# EAGLE schematic mippe_mobo (EAGLE 9.5.2)

## Sheet 1 of 4
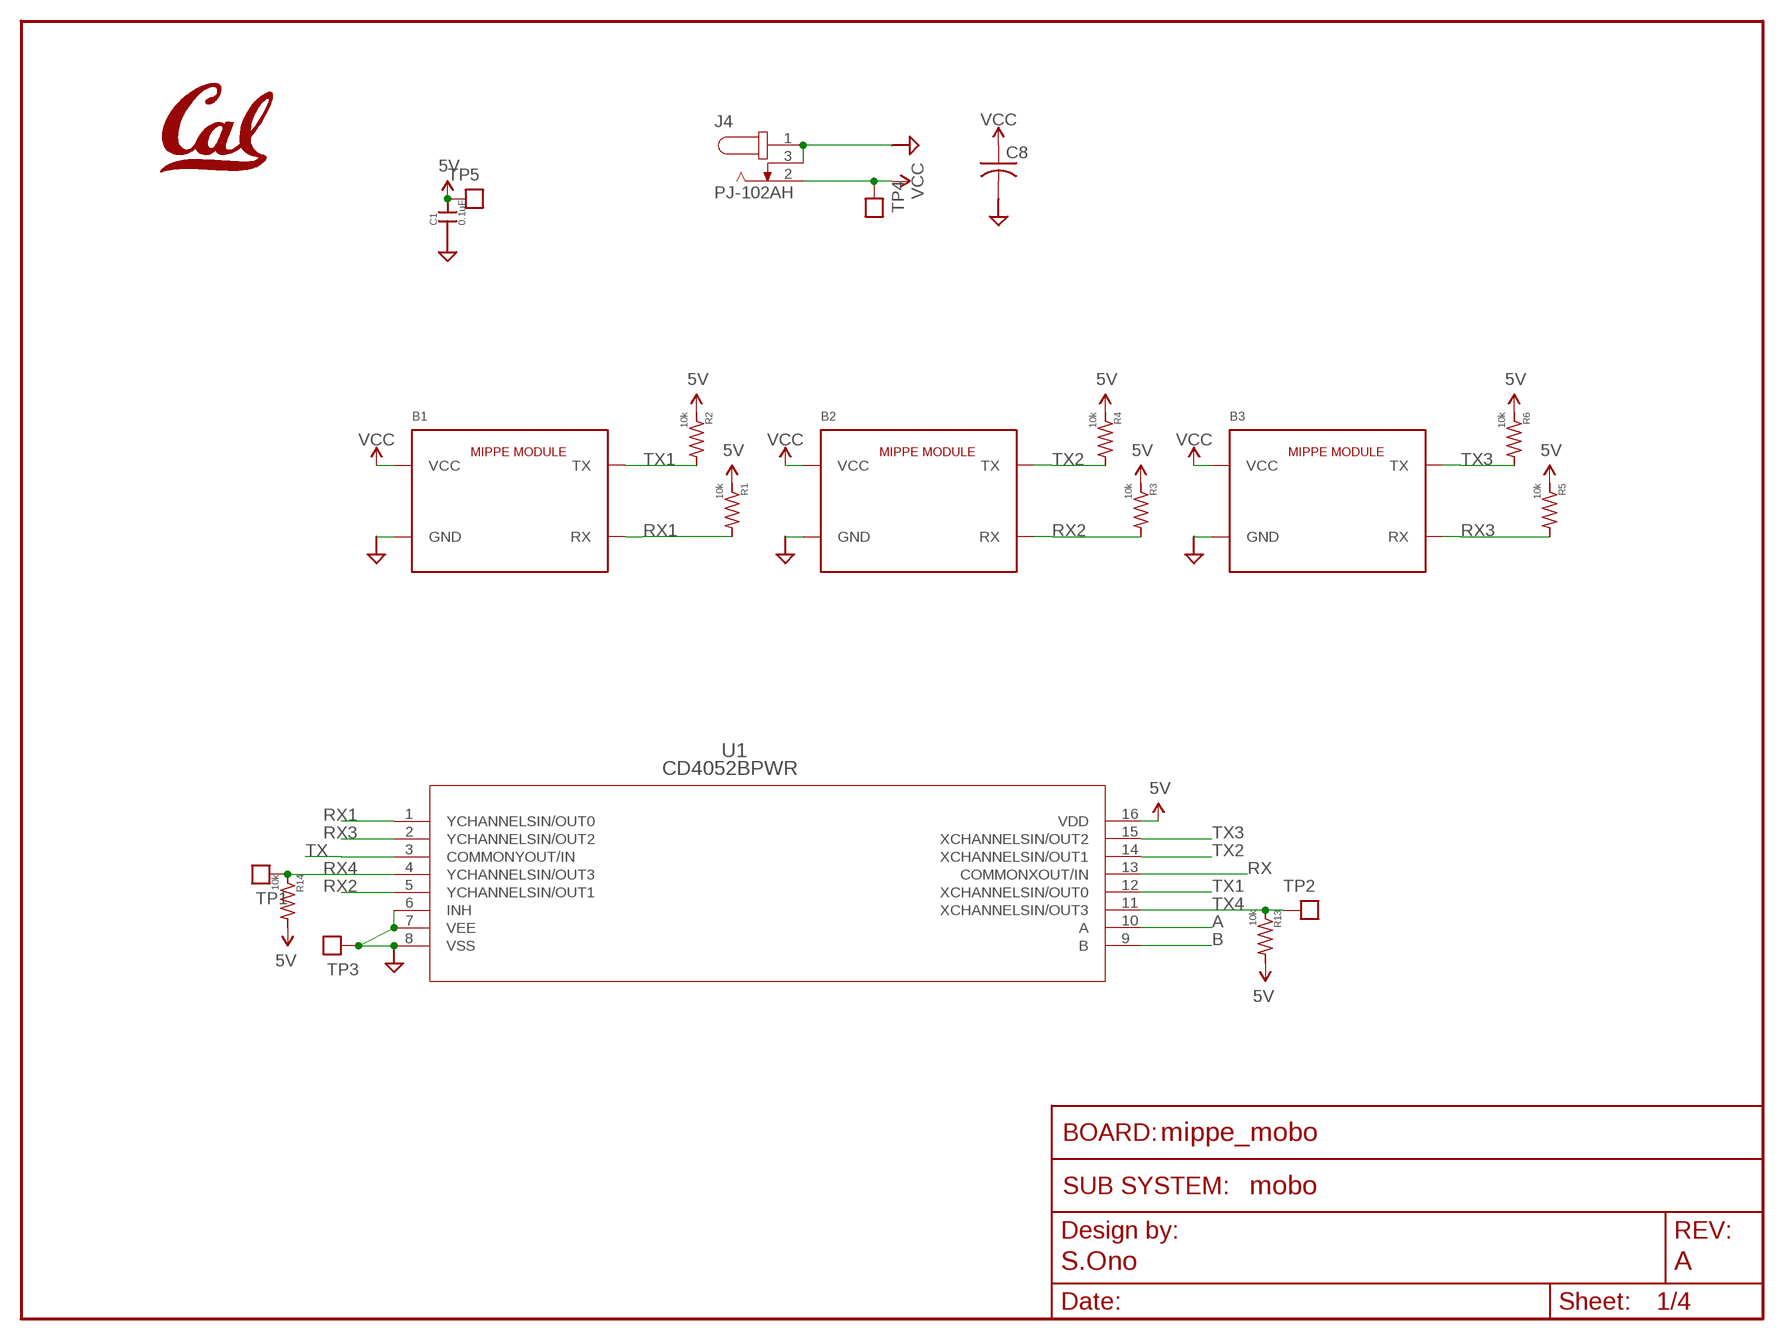
[diagram p0: schematic, sheet 1]
FRAME1 (FRAME_SCHEMATIC): AUTHOR: S.Ono; REV: A; SUBSYSTEM_NAME: mobo

### Parts
B1  MIPPE_MOD  [MIPPE_MOD]
B2  MIPPE_MOD  [MIPPE_MOD]
B3  MIPPE_MOD  [MIPPE_MOD]
C1  0.1uF  CAP0402-CAP  [0402-CAP]
C8  CAP_ELEC_3MM_SMD  [CAP_3MM]
J4  PJ-102AH  [CUI_PJ-102AH]
L1  UCB_CAL500MIL  [UCB_CAL_500MIL]
R1  10k  R-US_R0402  [R0402]
R2  10k  R-US_R0402  [R0402]
R3  10k  R-US_R0402  [R0402]
R4  10k  R-US_R0402  [R0402]
R5  10k  R-US_R0402  [R0402]
R6  10k  R-US_R0402  [R0402]
R13  10k  R-US_R0402  [R0402]
R14  10k  R-US_R0402  [R0402]
TP1  TEST_POINTTHRU  [TEST_POINT]
TP2  TEST_POINTTHRU  [TEST_POINT]
TP3  TEST_POINTTHRU  [TEST_POINT]
TP4  TEST_POINTTHRU  [TEST_POINT]
TP5  TEST_POINTTHRU  [TEST_POINT]
U1  CD4052BPWR  [PW16]

### Nets
5V: C1.2 R1.1 R2.1 R3.1 R4.1 R5.1 R6.1 R13.2 R14.2 TP5.1 U1.16(VDD) ; also sheet 3,4
A: U1.10(A) ; also sheet 4
B: U1.9(B) ; also sheet 4
GND: B1.GND@0(GND) B1.GND@1(GND) B1.GND@2(GND) B1.GND@3(GND) B2.GND@0(GND) B2.GND@1(GND) B2.GND@2(GND) B2.GND@3(GND) B3.GND@0(GND) B3.GND@1(GND) B3.GND@2(GND) B3.GND@3(GND) C1.1 C8.NEG J4.1 J4.3 TP3.1 U1.6(INH) U1.7(VEE) U1.8(VSS) ; also sheet 2,3,4
RX: U1.13(COMMONXOUT/IN) ; also sheet 4
RX1: B1.RX R1.2 U1.1(YCHANNELSIN/OUT0)
RX2: B2.RX R3.2 U1.5(YCHANNELSIN/OUT1)
RX3: B3.RX R5.2 U1.2(YCHANNELSIN/OUT2)
RX4: R14.1 TP1.1 U1.4(YCHANNELSIN/OUT3)
TX: U1.3(COMMONYOUT/IN) ; also sheet 4
TX1: B1.TX R2.2 U1.12(XCHANNELSIN/OUT0)
TX2: B2.TX R4.2 U1.14(XCHANNELSIN/OUT1)
TX3: B3.TX R6.2 U1.15(XCHANNELSIN/OUT2)
TX4: R13.1 TP2.1 U1.11(XCHANNELSIN/OUT3)
VCC: B1.VCC@0(VCC) B1.VCC@1(VCC) B1.VCC@2(VCC) B1.VCC@3(VCC) B2.VCC@0(VCC) B2.VCC@1(VCC) B2.VCC@2(VCC) B2.VCC@3(VCC) B3.VCC@0(VCC) B3.VCC@1(VCC) B3.VCC@2(VCC) B3.VCC@3(VCC) C8.POS J4.2 TP4.1

## Sheet 2 of 4
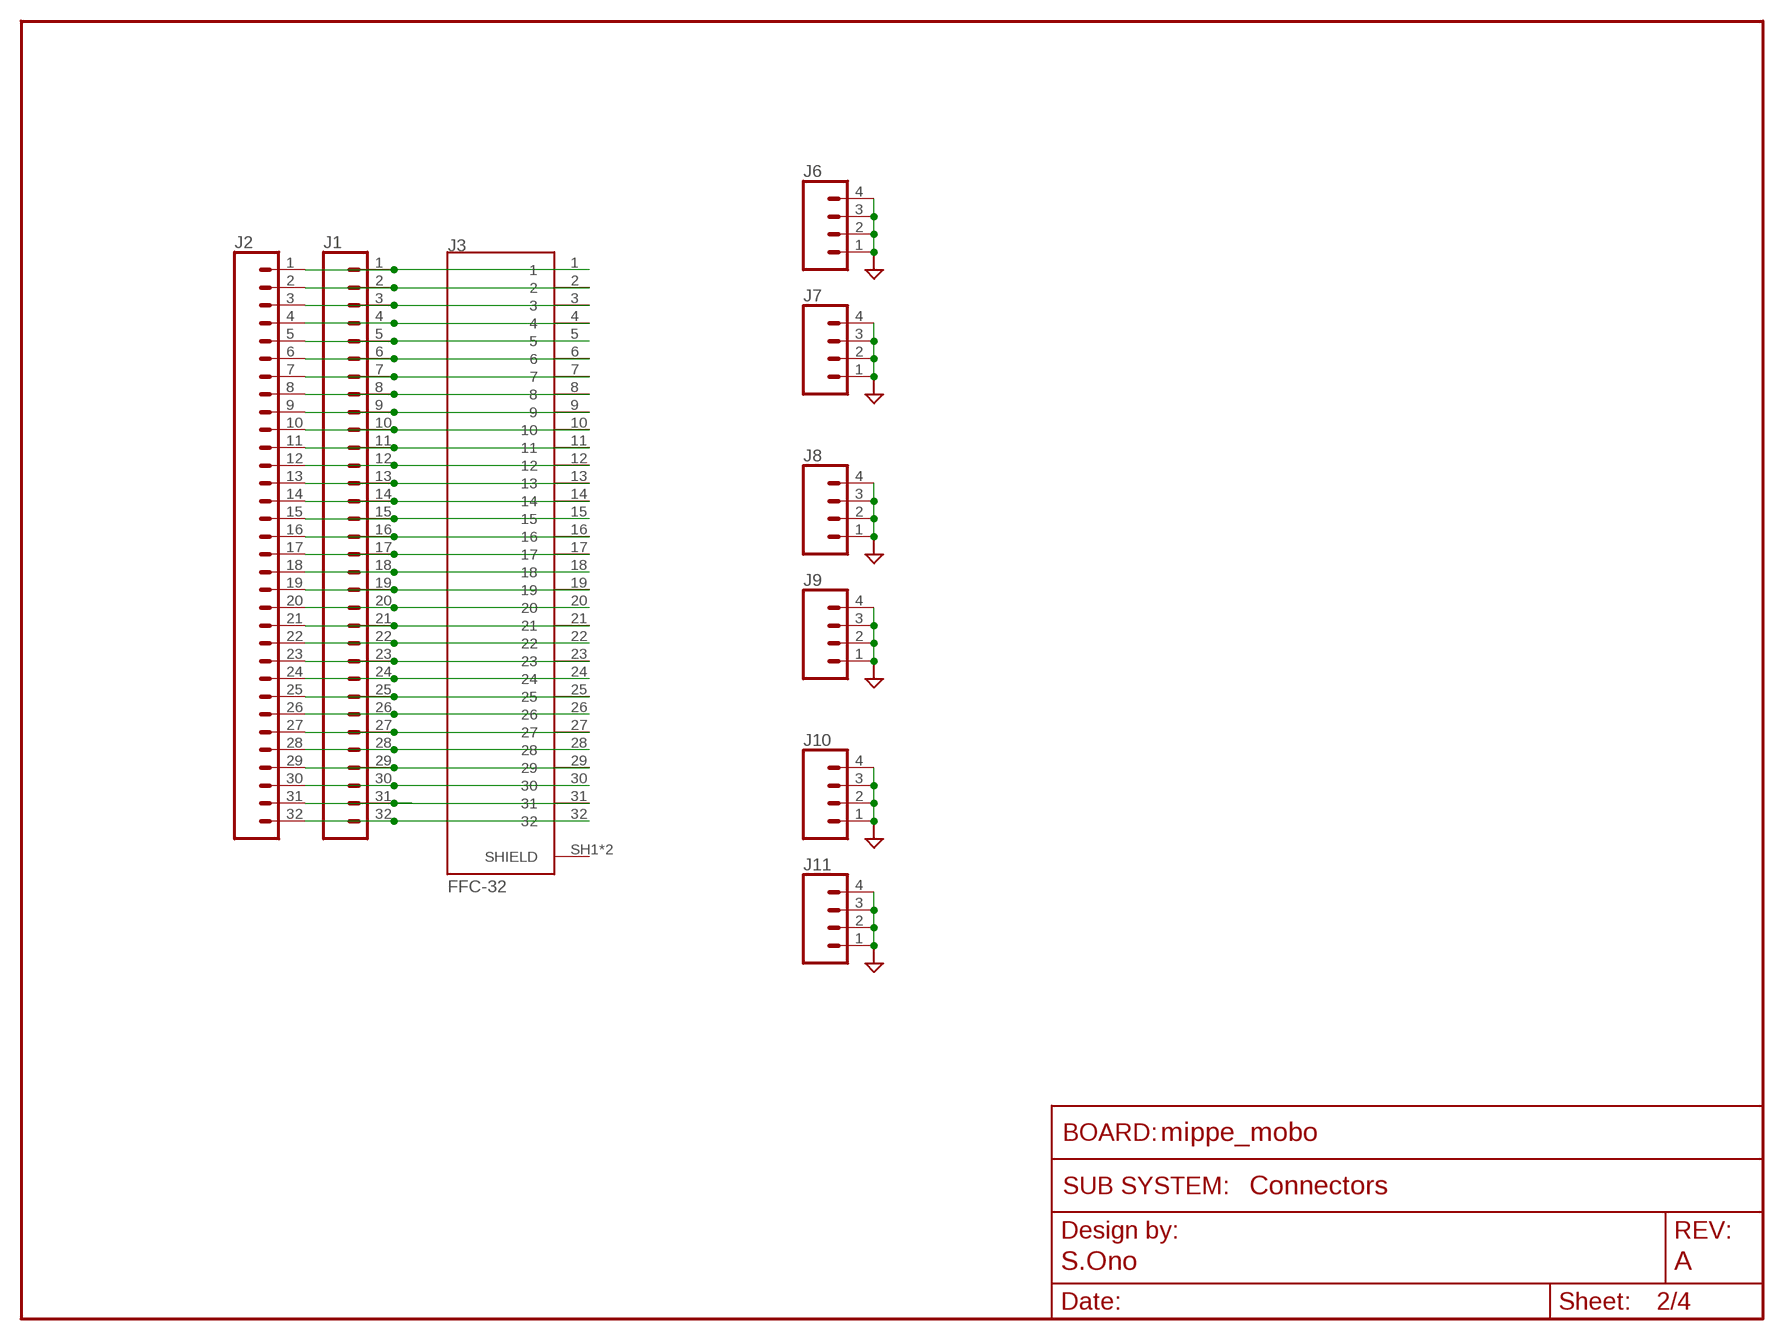
[diagram p1: schematic, sheet 2]
FRAME2 (FRAME_SCHEMATIC): AUTHOR: S.Ono; REV: A; SUBSYSTEM_NAME: Connectors

### Parts
J1  CONN_32  [1X32]
J2  CONN_32  [1X32]
J3  FFC-32  [MOLEX_503480-3200]
J6  CONN_04  [1X04]
J7  CONN_04  [1X04]
J8  CONN_04  [1X04]
J9  CONN_04  [1X04]
J10  CONN_04  [1X04]
J11  CONN_04  [1X04]

### Nets
GND: J6.1 J6.2 J6.3 J6.4 J7.1 J7.2 J7.3 J7.4 J8.1 J8.2 J8.3 J8.4 J9.1 J9.2 J9.3 J9.4 J10.1 J10.2 J10.3 J10.4 J11.1 J11.2 J11.3 J11.4 ; also sheet 1,3,4
N$1: J1.1 J2.1 J3.1
N$2: J1.2 J2.2 J3.2
N$3: J1.3 J2.3 J3.3
N$4: J1.4 J2.4 J3.4
N$5: J1.5 J2.5 J3.5
N$6: J1.6 J2.6 J3.6
N$7: J1.7 J2.7 J3.7
N$8: J1.8 J2.8 J3.8
N$9: J1.9 J2.9 J3.9
N$10: J1.10 J2.10 J3.10
N$11: J1.11 J2.11 J3.11
N$12: J1.12 J2.12 J3.12
N$13: J1.13 J2.13 J3.13
N$14: J1.14 J2.14 J3.14
N$15: J1.15 J2.15 J3.15
N$16: J1.16 J2.16 J3.16
N$17: J1.17 J2.17 J3.17
N$18: J1.18 J2.18 J3.18
N$19: J1.19 J2.19 J3.19
N$20: J1.20 J2.20 J3.20
N$21: J1.21 J2.21 J3.21
N$22: J1.22 J2.22 J3.22
N$23: J1.23 J2.23 J3.23
N$24: J1.24 J2.24 J3.24
N$25: J1.25 J2.25 J3.25
N$26: J1.26 J2.26 J3.26
N$27: J1.27 J2.27 J3.27
N$28: J1.28 J2.28 J3.28
N$29: J1.29 J2.29 J3.29
N$30: J1.30 J2.30 J3.30
N$31: J1.31 J2.31 J3.31
N$32: J1.32 J2.32 J3.32
Unconnected: J3.SH1(SHIELD) J3.SH2(SHIELD)

## Sheet 3 of 4
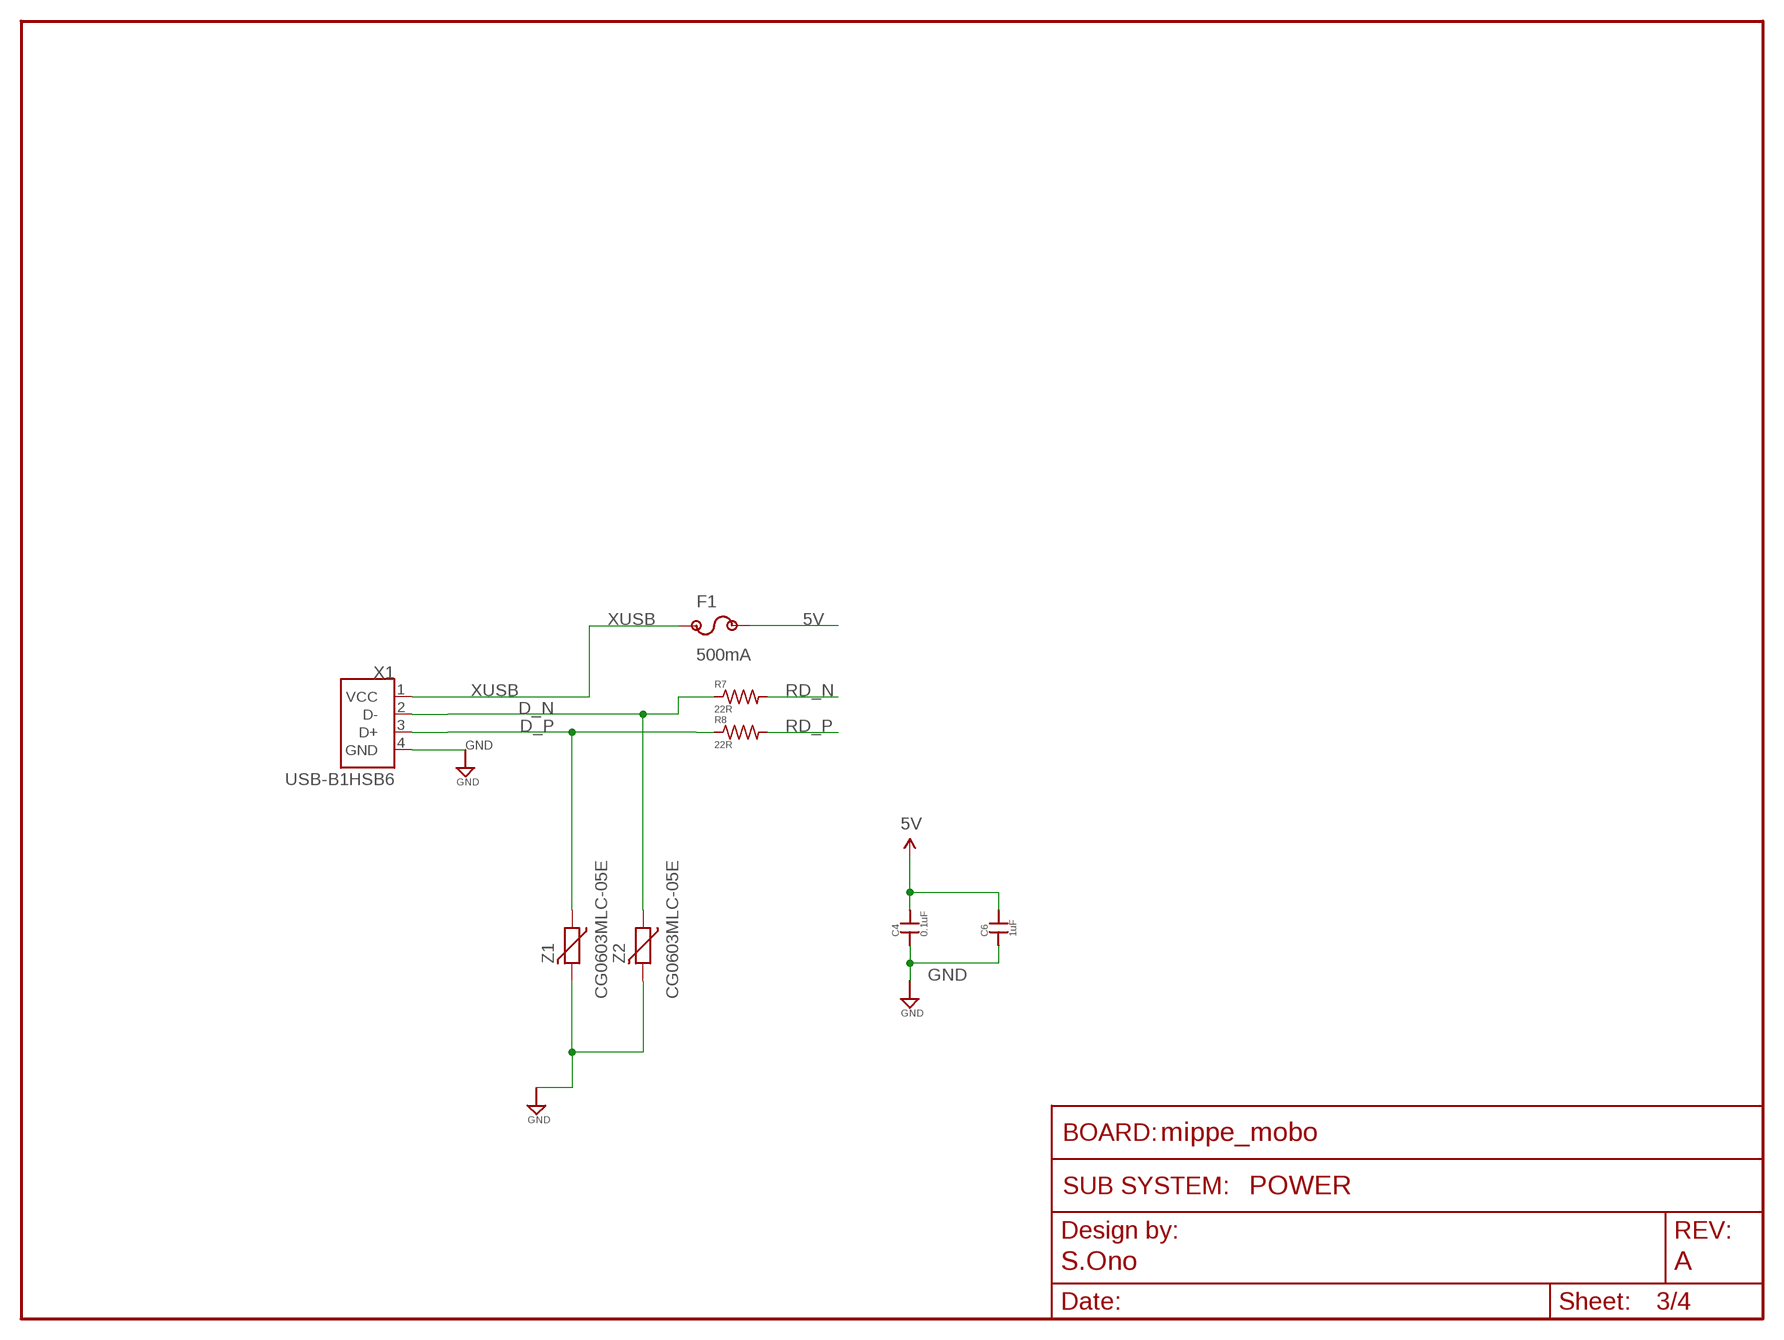
[diagram p2: schematic, sheet 3]
FRAME3 (FRAME_SCHEMATIC): AUTHOR: S.Ono; REV: A; SUBSYSTEM_NAME: POWER

### Parts
C4  0.1uF  CAP0402-CAP  [0402-CAP]
C6  1uF  CAP0402-CAP  [0402-CAP]
F1  500mA  0ZCJ0050FF2G1206  [1206]
R7  22R  R-US_R0402  [R0402]
R8  22R  R-US_R0402  [R0402]
X1  USB-B1HSB6  [OST_USB-B1HSB6]
Z1  CG0603MLC-05E  VARISTOR  [0603-RES]
Z2  CG0603MLC-05E  VARISTOR  [0603-RES]

### Nets
5V: C4.2 C6.2 F1.2 ; also sheet 1,4
D_N: R7.1 X1.2(D-) Z2.1
D_P: R8.1 X1.3(D+) Z1.1
GND: C4.1 C6.1 X1.4(GND) Z1.2 Z2.2 ; also sheet 1,2,4
RD_N: R7.2 ; also sheet 4
RD_P: R8.2 ; also sheet 4
XUSB: F1.1 X1.1(VCC)

## Sheet 4 of 4
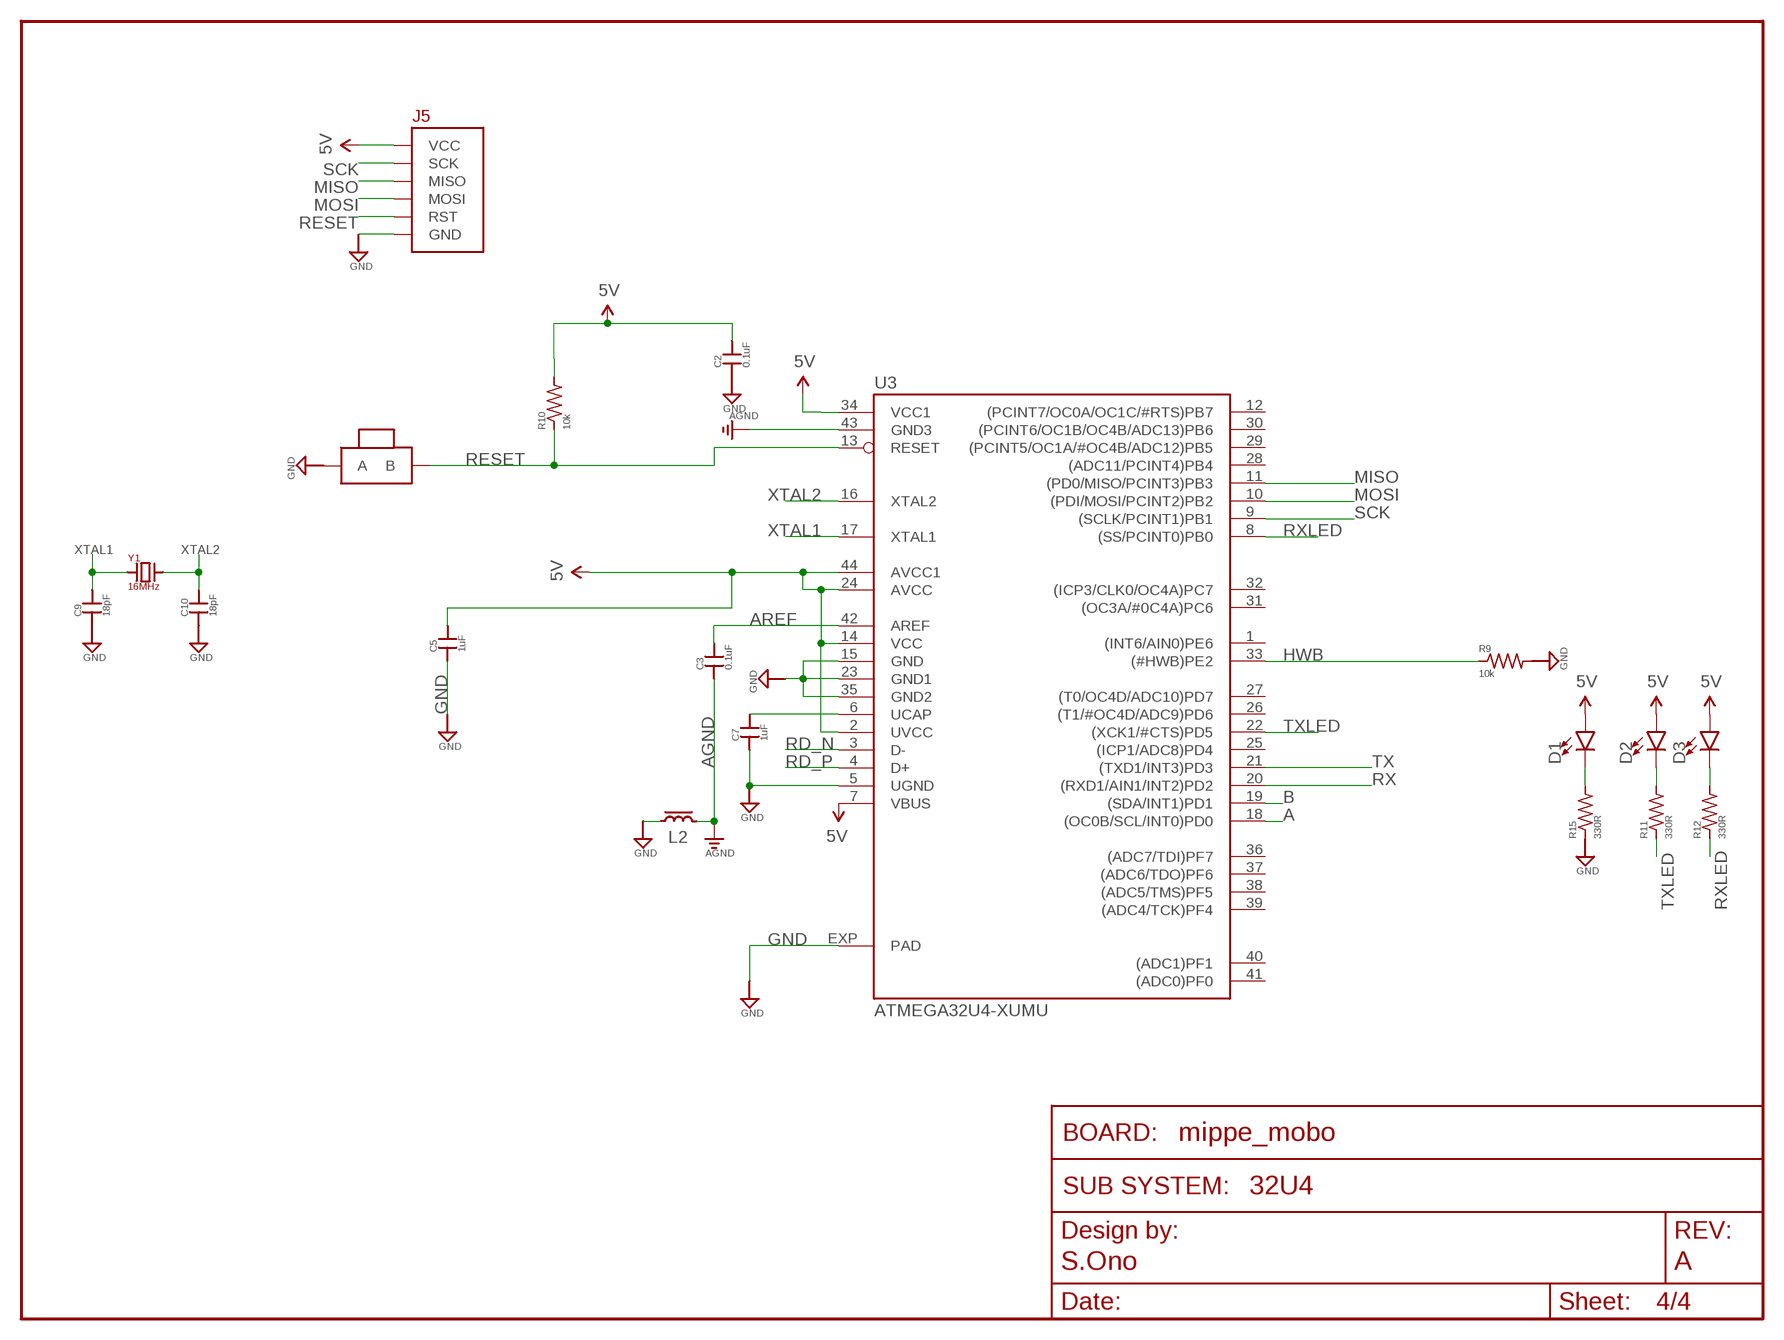
[diagram p3: schematic, sheet 4]
FRAME4 (FRAME_SCHEMATIC): AUTHOR: S.Ono; REV: A; SUBSYSTEM_NAME: 32U4

### Parts
C2  0.1uF  CAP0402-CAP  [0402-CAP]
C3  0.1uF  CAP0402-CAP  [0402-CAP]
C5  1uF  CAP0402-CAP  [0402-CAP]
C7  1uF  CAP0402-CAP  [0402-CAP]
C9  18pF  CAP0402-CAP  [0402-CAP]
C10  18pF  CAP0402-CAP  [0402-CAP]
D1  LED0603  [LED-0603]
D2  LED0603  [LED-0603]
D3  LED0603  [LED-0603]
J5  BURNIN  [BURNIN]
L2  IND  [IND_2012]
R9  10k  R-US_R0402  [R0402]
R10  10k  R-US_R0402  [R0402]
R11  330R  R-US_R0402  [R0402]
R12  330R  R-US_R0402  [R0402]
R15  330R  R-US_R0402  [R0402]
SW1  BTN-PTS810  [BTN_PTS810]
U3  ATMEGA32U4-XUMU  [QFN44ML7X7]
Y1  16MHz  CRYSTAL_SMOL  [XTAL500X320X130N]

### Nets
5V: C2.2 C5.2 D1.A D2.A D3.A J5.3.3V(VCC) R10.2 U3.2(UVCC) U3.7(VBUS) U3.14(VCC) U3.24(AVCC) U3.34(VCC1) U3.44(AVCC1) ; also sheet 1,3
A: U3.18((OC0B/SCL/INT0)PD0) ; also sheet 1
AGND: C3.1 L2.2 U3.43(GND3)
AREF: C3.2 U3.42(AREF)
B: U3.19((SDA/INT1)PD1) ; also sheet 1
GND: C2.1 C5.1 C7.1 C9.1 C10.1 J5.GND L2.1 R9.2 R15.1 SW1.1(A) SW1.2(A) U3.5(UGND) U3.15(GND) U3.23(GND1) U3.35(GND2) U3.EXP(PAD) ; also sheet 1,2,3
HWB: R9.1 U3.33((#HWB)PE2)
MISO: J5.MISO U3.11((PD0/MISO/PCINT3)PB3)
MOSI: J5.MOSI U3.10((PDI/MOSI/PCINT2)PB2)
N$33: D2.C R11.2
N$34: D3.C R12.2
N$35: D1.C R15.2
RD_N: U3.3(D-) ; also sheet 3
RD_P: U3.4(D+) ; also sheet 3
RESET: J5.RST R10.1 SW1.3(B) SW1.4(B) U3.13(RESET)
RX: U3.20((RXD1/AIN1/INT2)PD2) ; also sheet 1
RXLED: R12.1 U3.8((SS/PCINT0)PB0)
SCK: J5.SCK U3.9((SCLK/PCINT1)PB1)
TX: U3.21((TXD1/INT3)PD3) ; also sheet 1
TXLED: R11.1 U3.22((XCK1/#CTS)PD5)
UCAP: C7.2 U3.6(UCAP)
XTAL1: C9.2 U3.17(XTAL1) Y1.1(A)
XTAL2: C10.2 U3.16(XTAL2) Y1.2(B)
Unconnected: U3.1((INT6/AIN0)PE6) U3.12((PCINT7/OC0A/OC1C/#RTS)PB7) U3.25((ICP1/ADC8)PD4) U3.26((T1/#OC4D/ADC9)PD6) U3.27((T0/OC4D/ADC10)PD7) U3.28((ADC11/PCINT4)PB4) U3.29((PCINT5/OC1A/#OC4B/ADC12)PB5) U3.30((PCINT6/OC1B/OC4B/ADC13)PB6) U3.31((OC3A/#0C4A)PC6) U3.32((ICP3/CLK0/OC4A)PC7) U3.36((ADC7/TDI)PF7) U3.37((ADC6/TDO)PF6) U3.38((ADC5/TMS)PF5) U3.39((ADC4/TCK)PF4) U3.40((ADC1)PF1) U3.41((ADC0)PF0)

## Library data of the parts
B1-B3 = scono:MIPPE_MOD
C1-C7 C9 C10 = scono:CAP: Capacitor Standard 0603 ceramic capacitor, and 0.1" leaded capacitor.; PIE-INT-REF-NUM: CAPACITOR-GENERIC
C8 = scono:CAP_ELEC: https://www.digikey.com/product-detail/en/nichicon/UWX1C100MCL2GB/493-2099-1-ND/590074
D1-D3 = scono:LED: https://www.digikey.com/products/en/optoelectronics/led-indication-discrete/105?k=&pkeyword=&pv7=2&pv1989=0&pv16=5&FV=ffe00069&quantity=0&ColumnSort=0&page=1&pageSize=25
F1 = scono:0ZCJ0050FF2G: https://www.digikey.com/product-detail/en/bel-fuse-inc/0ZCJ0050FF2G/507-1802-1-ND/4156236
J1 J2 = scono:CONN_32: Multi connection point. Often used as Generic Header-pin footprint for 0.1 inch spaced/style header connections On any of the 0.1 inch spaced packages, you can populate with these: Break Away Headers - Straight <https://www.sparkfun.com/products/116> (PRT-00116) Break Away Male Headers - Right Angle <https://www.sparkfun.com/products/553> (PRT-00553) Female Headers <https://www.sparkfun.com/products/115> (PRT-00115) Break Away Headers - Machine Pin <https://www.sparkfun.com/products/117> (PRT-00117) Break Away Female Headers - Swiss Machine Pin <https://www.sparkfun.com/products/743> (PRT-00743) Arduino Stackable Header - 8 Pin <https://www.sparkfun.com/products/9279> (PRT-09279) For SCREWTERMINALS and SPRING TERMINALS visit here: Screw Terimnals on SparkFun.com <https://www.sparkfun.com/search/results?term=Screw+Terminals> (5mm/3.5mm/2.54mm spacing) This device is also useful as a general connection point to wire up your design to another part of your project. Our various solder wires solder well into these plated through hole pads. Hook-Up Wire - Assortment (Stranded, 22 AWG) <https://www.sparkfun.com/products/11375> (PRT-11375) Hook-Up Wire - Assortment (Solid Core, 22 AWG) <https://www.sparkfun.com/products/11367> (PRT-11367) View the entire wire category on our website here <https://www.sparkfun.com/categories/141> Special notes: Molex polarized connector foot print use with SKU : PRT-08231 with associated crimp pins and housings. 1MM SMD Version SKU: PRT-10208 NOTES ON THE VARIANTS LOCK and LOCK_LONGPADS... This footprint was designed to help hold the alignment of a through-hole component (i.e. 6-pin header) while soldering it into place. You may notice that each hole has been shifted either up or down by 0.005 of an inch from it's more standard position (which is a perfectly straight line). This slight alteration caused the pins (the squares in the middle) to touch the edges of the holes. Because they are alternating, it causes a "brace" to hold the component in place. 0.005 has proven to be the perfect amount of "off-center" position when using our standard breakaway headers. Although looks a little odd when you look at the bare footprint, once you have a header in there, the alteration is very hard to notice. Also,if you push a header all the way into place, it is covered up entirely on the bottom side.
J3 = scono:FFC-32: 0.50mm Pitch Easy-On™ BackFlip™ Type FPC Connector, 1.00mm Height, Right Angle, SMT, Dual Contact Style, 32 Circuits; DESCRIPTION: 0.50mm Pitch Easy-On™ BackFlip™ Type FPC Connector, 1.00mm Height, Right Angle, Surface Mount, Dual Contact Style, 32...; DIGI-KEY_PART_NUMBER: WM11115CT-ND; DIGI-KEY_PURCHASE_URL: https://www.digikey.com/product-detail/en/molex/5034803200/WM11115CT-ND/5171273?utm_source=snapeda&utm_medium=aggregator&utm_campaign=symbol; MF: Molex; MP: 5034803200; PACKAGE: None
J4 = scono:PJ-102AH: 2.0 mm Center Pin, 5.0 A, Right Angle, Through Hole, Tapered Pins, Dc Power Jack Connector; AVAILABILITY: Unavailable; CUI_PURCHASE_URL: https://www.cuidevices.com/product/interconnect/connectors/dc-power-connectors/jacks/pj-102ah?utm_source=snapeda.com&utm_medium=referral&utm_campaign=snapedaBOM; DESCRIPTION: 2.0 x 6.5 mm, 5.0 A, Horizontal, Through Hole, Tapered Pins, Dc Power Jack Connector; MF: CUI Devices; MP: PJ-102AH; PACKAGE: None; PRICE: None
J5 = scono:BURNIN
J6-J11 = scono:CONN_04: Multi connection point. Often used as Generic Header-pin footprint for 0.1 inch spaced/style header connections On any of the 0.1 inch spaced packages, you can populate with these: Break Away Headers - Straight <https://www.sparkfun.com/products/116> (PRT-00116) Break Away Male Headers - Right Angle <https://www.sparkfun.com/products/553> (PRT-00553) Female Headers <https://www.sparkfun.com/products/115> (PRT-00115) Break Away Headers - Machine Pin <https://www.sparkfun.com/products/117> (PRT-00117) Break Away Female Headers - Swiss Machine Pin <https://www.sparkfun.com/products/743> (PRT-00743) For SCREWTERMINALS and SPRING TERMINALS visit here: Screw Terimnals on SparkFun.com <https://www.sparkfun.com/search/results?term=Screw+Terminals> (5mm/3.5mm/2.54mm spacing) This device is also useful as a general connection point to wire up your design to another part of your project. Our various solder wires solder well into these plated through hole pads. Hook-Up Wire - Assortment (Stranded, 22 AWG) <https://www.sparkfun.com/products/11375> (PRT-11375) Hook-Up Wire - Assortment (Solid Core, 22 AWG) <https://www.sparkfun.com/products/11367> (PRT-11367) View the entire wire category on our website here <https://www.sparkfun.com/categories/141> Special notes: Molex polarized connector foot print use with SKU : PRT-08231 with associated crimp pins and housings. 1MM SMD Version SKU: PRT-10208; PROD_ID: CONN-09696
L1 = scono:UCB_CAL
L2 = scono:IND; MANUFACTURER_PART_NUMBER: MLZ2012M1R0HT000; VENDOR: TDK
R1-R15 = scono:R-US_: RESISTOR, American symbol
SW1 = scono:BTN-PTS810: https://www.digikey.com/product-detail/en/c-k/PTS810-SJM-250-SMTR-LFS/CKN10502CT-ND/4176673
TP1-TP5 = scono:TEST_POINT: 1206 Test point for O-scope probes. For A106146CT-ND or similar
U1 = scono:CD4052BPWR; BUILT_BY: EMA_UL_Team; MANUFACTURER: Texas Instruments; MANUFACTURER_PART_NUMBER: CD4052BPWR; VENDOR: Vendor
U3 = scono:ATMEGA32U4-XU
X1 = scono:USB-B1HSB6: Conn Usb Type b r/a Black; DESCRIPTION: USB - B Receptacle Connector 4 Position Through Hole, Right Angle; DIGI-KEY_PART_NUMBER: ED2983-ND; DIGI-KEY_PURCHASE_URL: https://www.digikey.com/product-detail/en/on-shore-technology-inc/USB-B1HSB6/ED2983-ND/2677744?utm_source=snapeda&utm_medium=aggregator&utm_campaign=symbol; MF: On Shore; MP: USB-B1HSB6; PACKAGE: None
Y1 = scono:CRYSTAL
Z1 Z2 = scono:VARISTOR: VARISTOR

## Net classes
1 supply: width 0.152 mm, drill 0.152 mm, clearance 0.152 mm